# Altium schematic sheet IO_Carte_Nucleo_.SchDoc: I/O Carte Nucleo
size A4; Author: Xavier Hueber; Engineer: Xavier Hueber; Organization: Altium Limited; Address1: Laboratoire de Systèmes Embarqués; Address2: 7, rue de la Serre; Address3: 2610 Saint-Imier / Switzerland; Revision: 1; SheetNumber: 3; SheetTotal: 4
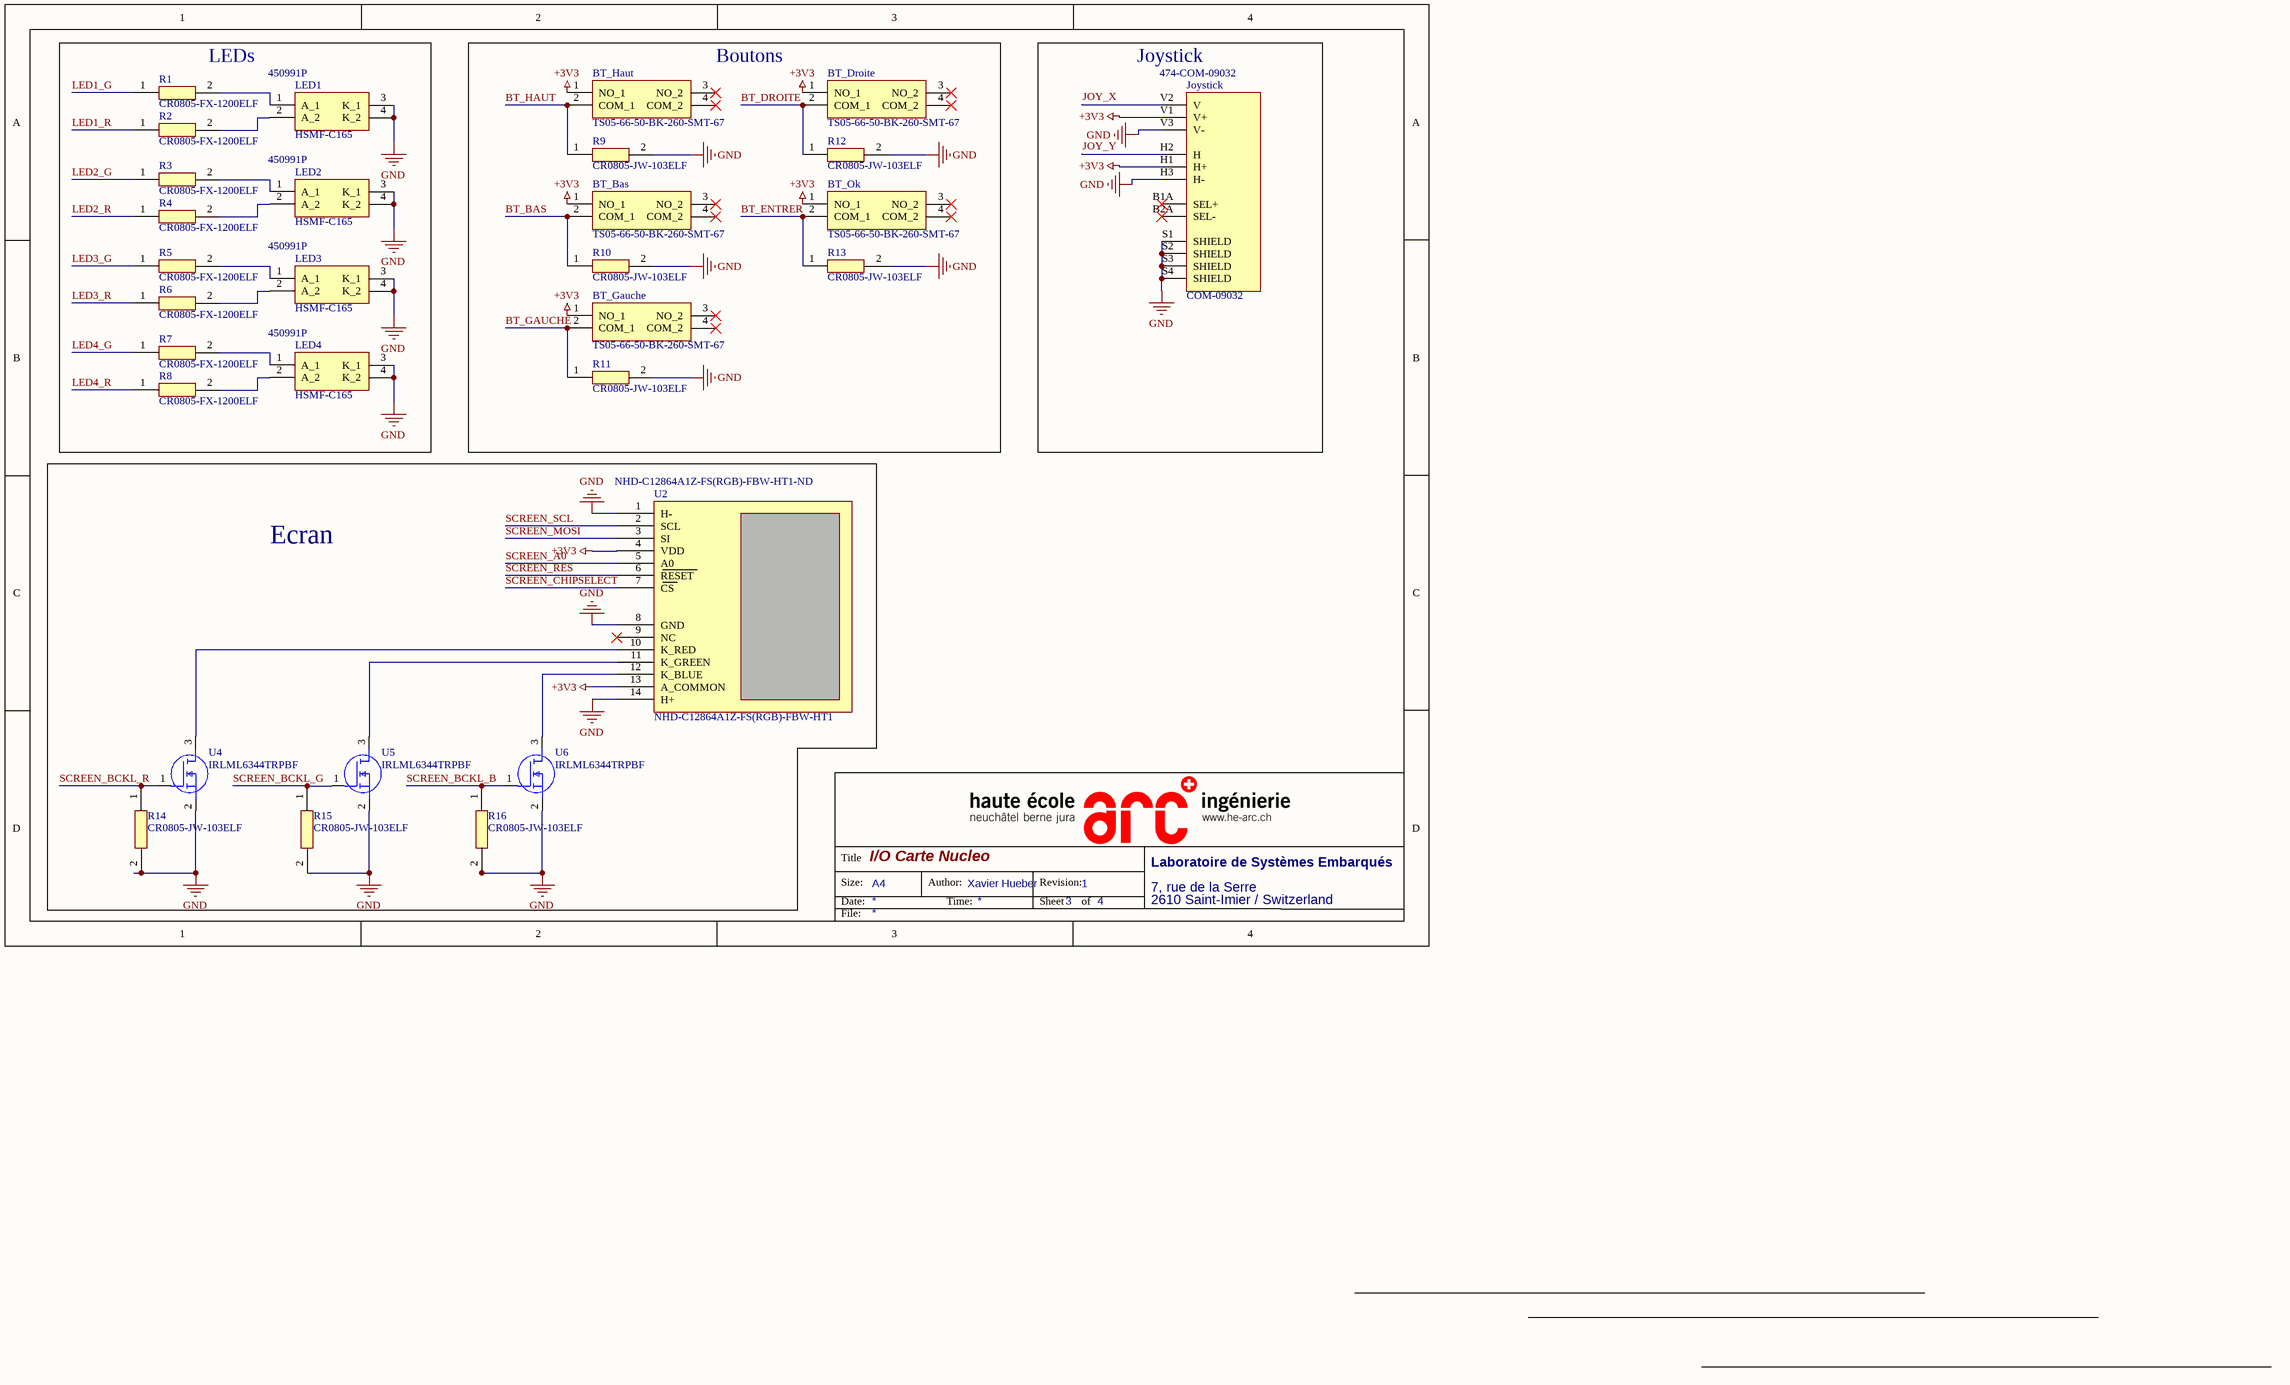
[diagram p0: IO_Carte_Nucleo_.SchDoc]

## Parts
BT_Bas  TS05-66-50-BK-260-SMT-67  [TS056650BK260SMT67]
BT_Droite  TS05-66-50-BK-260-SMT-67  [TS056650BK260SMT67]
BT_Gauche  TS05-66-50-BK-260-SMT-67  [TS056650BK260SMT67]
BT_Haut  TS05-66-50-BK-260-SMT-67  [TS056650BK260SMT67]
BT_Ok  TS05-66-50-BK-260-SMT-67  [TS056650BK260SMT67]
Joystick  COM-09032  Supplier Part Number 1: 474-COM-09032  [XDCR_COM-09032]
LED1  HSMF-C165  Supplier Part Number 1: 450991P  [HSMF-C163]
LED2  HSMF-C165  Supplier Part Number 1: 450991P  [HSMF-C163]
LED3  HSMF-C165  Supplier Part Number 1: 450991P  [HSMF-C163]
LED4  HSMF-C165  Supplier Part Number 1: 450991P  [HSMF-C163]
R1  CR0805-FX-1200ELF  [RESC2012X60N]
R2  CR0805-FX-1200ELF  [RESC2012X60N]
R3  CR0805-FX-1200ELF  [RESC2012X60N]
R4  CR0805-FX-1200ELF  [RESC2012X60N]
R5  CR0805-FX-1200ELF  [RESC2012X60N]
R6  CR0805-FX-1200ELF  [RESC2012X60N]
R7  CR0805-FX-1200ELF  [RESC2012X60N]
R8  CR0805-FX-1200ELF  [RESC2012X60N]
R9  CR0805-JW-103ELF  [RESC2012X60N]
R10  CR0805-JW-103ELF  [RESC2012X60N]
R11  CR0805-JW-103ELF  [RESC2012X60N]
R12  CR0805-JW-103ELF  [RESC2012X60N]
R13  CR0805-JW-103ELF  [RESC2012X60N]
R14  CR0805-JW-103ELF  [RESC2012X60N]
R15  CR0805-JW-103ELF  [RESC2012X60N]
R16  CR0805-JW-103ELF  [RESC2012X60N]
U2  NHD-C12864A1Z-FS(RGB)-FBW-HT1  Supplier Part Number 1: NHD-C12864A1Z-FS(RGB)-FBW-HT1-ND  [NHD-C12864A1Z-FS(RGB)-FBW-HT1]
U4  IRLML6344TRPBF  [SOT95P237X112-3N]
U5  IRLML6344TRPBF  [SOT95P237X112-3N]
U6  IRLML6344TRPBF  [SOT95P237X112-3N]

## Blocks framed on the sheet
LEDs: LED1-LED4 R1-R8
Boutons: BT_Bas BT_Droite BT_Gauche BT_Haut BT_Ok R9-R13
Joystick: Joystick

## Nets
+3V3: BT_Bas.1(NO_1) BT_Droite.1(NO_1) BT_Gauche.1(NO_1) BT_Haut.1(NO_1) BT_Ok.1(NO_1) Joystick.H1(H+) Joystick.V1(V+) U2.4(VDD) U2.13(A_COMMON)
GND: Joystick.H3(H-) Joystick.S1(SHIELD) Joystick.S2(SHIELD) Joystick.S3(SHIELD) Joystick.S4(SHIELD) Joystick.V3(V-) LED1.3(K_1) LED1.4(K_2) LED2.3(K_1) LED2.4(K_2) LED3.3(K_1) LED3.4(K_2) LED4.3(K_1) LED4.4(K_2) R9.2 R10.2 R11.2 R12.2 R13.2 R14.2 R15.2 R16.2 U2.1(H-) U2.8(GND) U2.14(H+) U4.2(S) U5.2(S) U6.2(S)
BT_BAS: BT_Bas.2(COM_1) R10.1
BT_DROITE: BT_Droite.2(COM_1) R12.1
BT_ENTRER: BT_Ok.2(COM_1) R13.1
BT_GAUCHE: BT_Gauche.2(COM_1) R11.1
BT_HAUT: BT_Haut.2(COM_1) R9.1
JOY_X: Joystick.V2(V)
JOY_Y: Joystick.H2(H)
LED1_G: R1.1
LED1_R: R2.1
LED2_G: R3.1
LED2_R: R4.1
LED3_G: R5.1
LED3_R: R6.1
LED4_G: R7.1
LED4_R: R8.1
SCREEN_A0: U2.5(A0)
SCREEN_BCKL_B: R16.1 U6.1(G)
SCREEN_BCKL_G: R15.1 U5.1(G)
SCREEN_BCKL_R: R14.1 U4.1(G)
SCREEN_CHIPSELECT: U2.7(CS)
SCREEN_MOSI: U2.3(SI)
SCREEN_RES: U2.6(RESET)
SCREEN_SCL: U2.2(SCL)
NetLED1_1: LED1.1(A_1) R1.2
NetLED1_2: LED1.2(A_2) R2.2
NetLED2_1: LED2.1(A_1) R3.2
NetLED2_2: LED2.2(A_2) R4.2
NetLED3_1: LED3.1(A_1) R5.2
NetLED3_2: LED3.2(A_2) R6.2
NetLED4_1: LED4.1(A_1) R7.2
NetLED4_2: LED4.2(A_2) R8.2
NetU2_10: U2.10(K_RED) U4.3(D)
NetU2_11: U2.11(K_GREEN) U5.3(D)
NetU2_12: U2.12(K_BLUE) U6.3(D)

Not connected (* = marked no-connect by the designer): BT_Bas 3(NO_2)* 4(COM_2)*; BT_Droite 3(NO_2)* 4(COM_2)*; BT_Gauche 3(NO_2)* 4(COM_2)*; BT_Haut 3(NO_2)* 4(COM_2)*; BT_Ok 3(NO_2)* 4(COM_2)*; Joystick B1A(SEL+)* B2A(SEL-)*; U2 9(NC)*

## Notes on the sheet
- Ecran
- Title
- Size:
- Date:
- A4
- Author:
- Time:
- Revision:
- Sheet
- of
- File:

## Library data of the parts
BT_Bas BT_Droite BT_Gauche BT_Haut BT_Ok = TS05-66-50-BK-260-SMT-67: 6 x 6 mm, 4.3 ~ 8 mm Actuator Height, 100 ~ 260 gf, Surface Mount, IP67, SPST, Tactile Switch; Datasheet Link: https://www.cuidevices.com/product/resource/ts05.pdf; Height: 5.2mm; Supplier 1: Mouser; Supplier Part Number 1: 179-TS056650260SMT67
Joystick = COM-09032: Thumb Joystick; Price: None; Package: None; Availability: Unavailable; MP: COM-09032; Value: *; Supplier 1: Mouser
LED1-LED4 = HSMF-C165: Standard LEDs - SMD Grn/Red Bi-Color; Manufacturer_Name: Avago Technologies; Datasheet Link: https://componentsearchengine.com//HSMF-C165.pdf; Mouser2 Part Number: 630-HSMF-C165; Mouser2 Price/Stock: https://www.mouser.com/Search/Refine.aspx?Keyword=630-HSMF-C165; Manufacturer_Part_Number: HSMF-C165; Supplier 1: RSComponents
R1-R8 = CR0805-FX-1200ELF: Res Thick Film 0805 120 Ohm 1% 1/8W ±100ppm/°C Molded SMD SMD Paper Tape on Plastic Reel; Datasheet Link: https://www.bourns.com/pdfs/chpreztr.pdf; Height: 0.6mm; Supplier 1: Arrow Electronics; Supplier Part Number 1: CR0805-FX-1200ELF
R9-R16 = CR0805-JW-103ELF: BOURNS         CR0805-JW-103ELF            Surface Mount Chip Resistor, Thick Film, CR Series, 10 kohm, 125 mW,  5%, 150 V; Datasheet Link: https://componentsearchengine.com//CR0805-JW-103ELF.pdf; Height: 0.6mm; Supplier 1: Arrow Electronics; Supplier Part Number 1: CR0805-JW-103ELF
U2 = NHD-C12864A1Z-FS(RGB)-FBW-HT1: LCD COG GRAPH 128X64 RGB BKLT; Supplier 1: Digi-Key
U4-U6 = IRLML6344TRPBF: MOSFET (N-Channel); Manufacturer_Name: Infineon; Datasheet Link: https://componentsearchengine.com//IRLML6344TRPBF.pdf; Height: 1.12mm; Mouser2 Part Number: 942-IRLML6344TRPBF; Mouser2 Price/Stock: https://www.mouser.com/Search/Refine.aspx?Keyword=942-IRLML6344TRPBF; Manufacturer_Part_Number: IRLML6344TRPBF